# EasyEDA Pro project SSR Switch.eprj

# Schematic 250mA 48V AC/DC
Board Name: V3.0.0; Create Date: 2026-01-19; Page Name: Main Page; Project Name: SSR Switch; Schematic Name: 250mA 48V AC/DC; Update Date: 2026-01-19
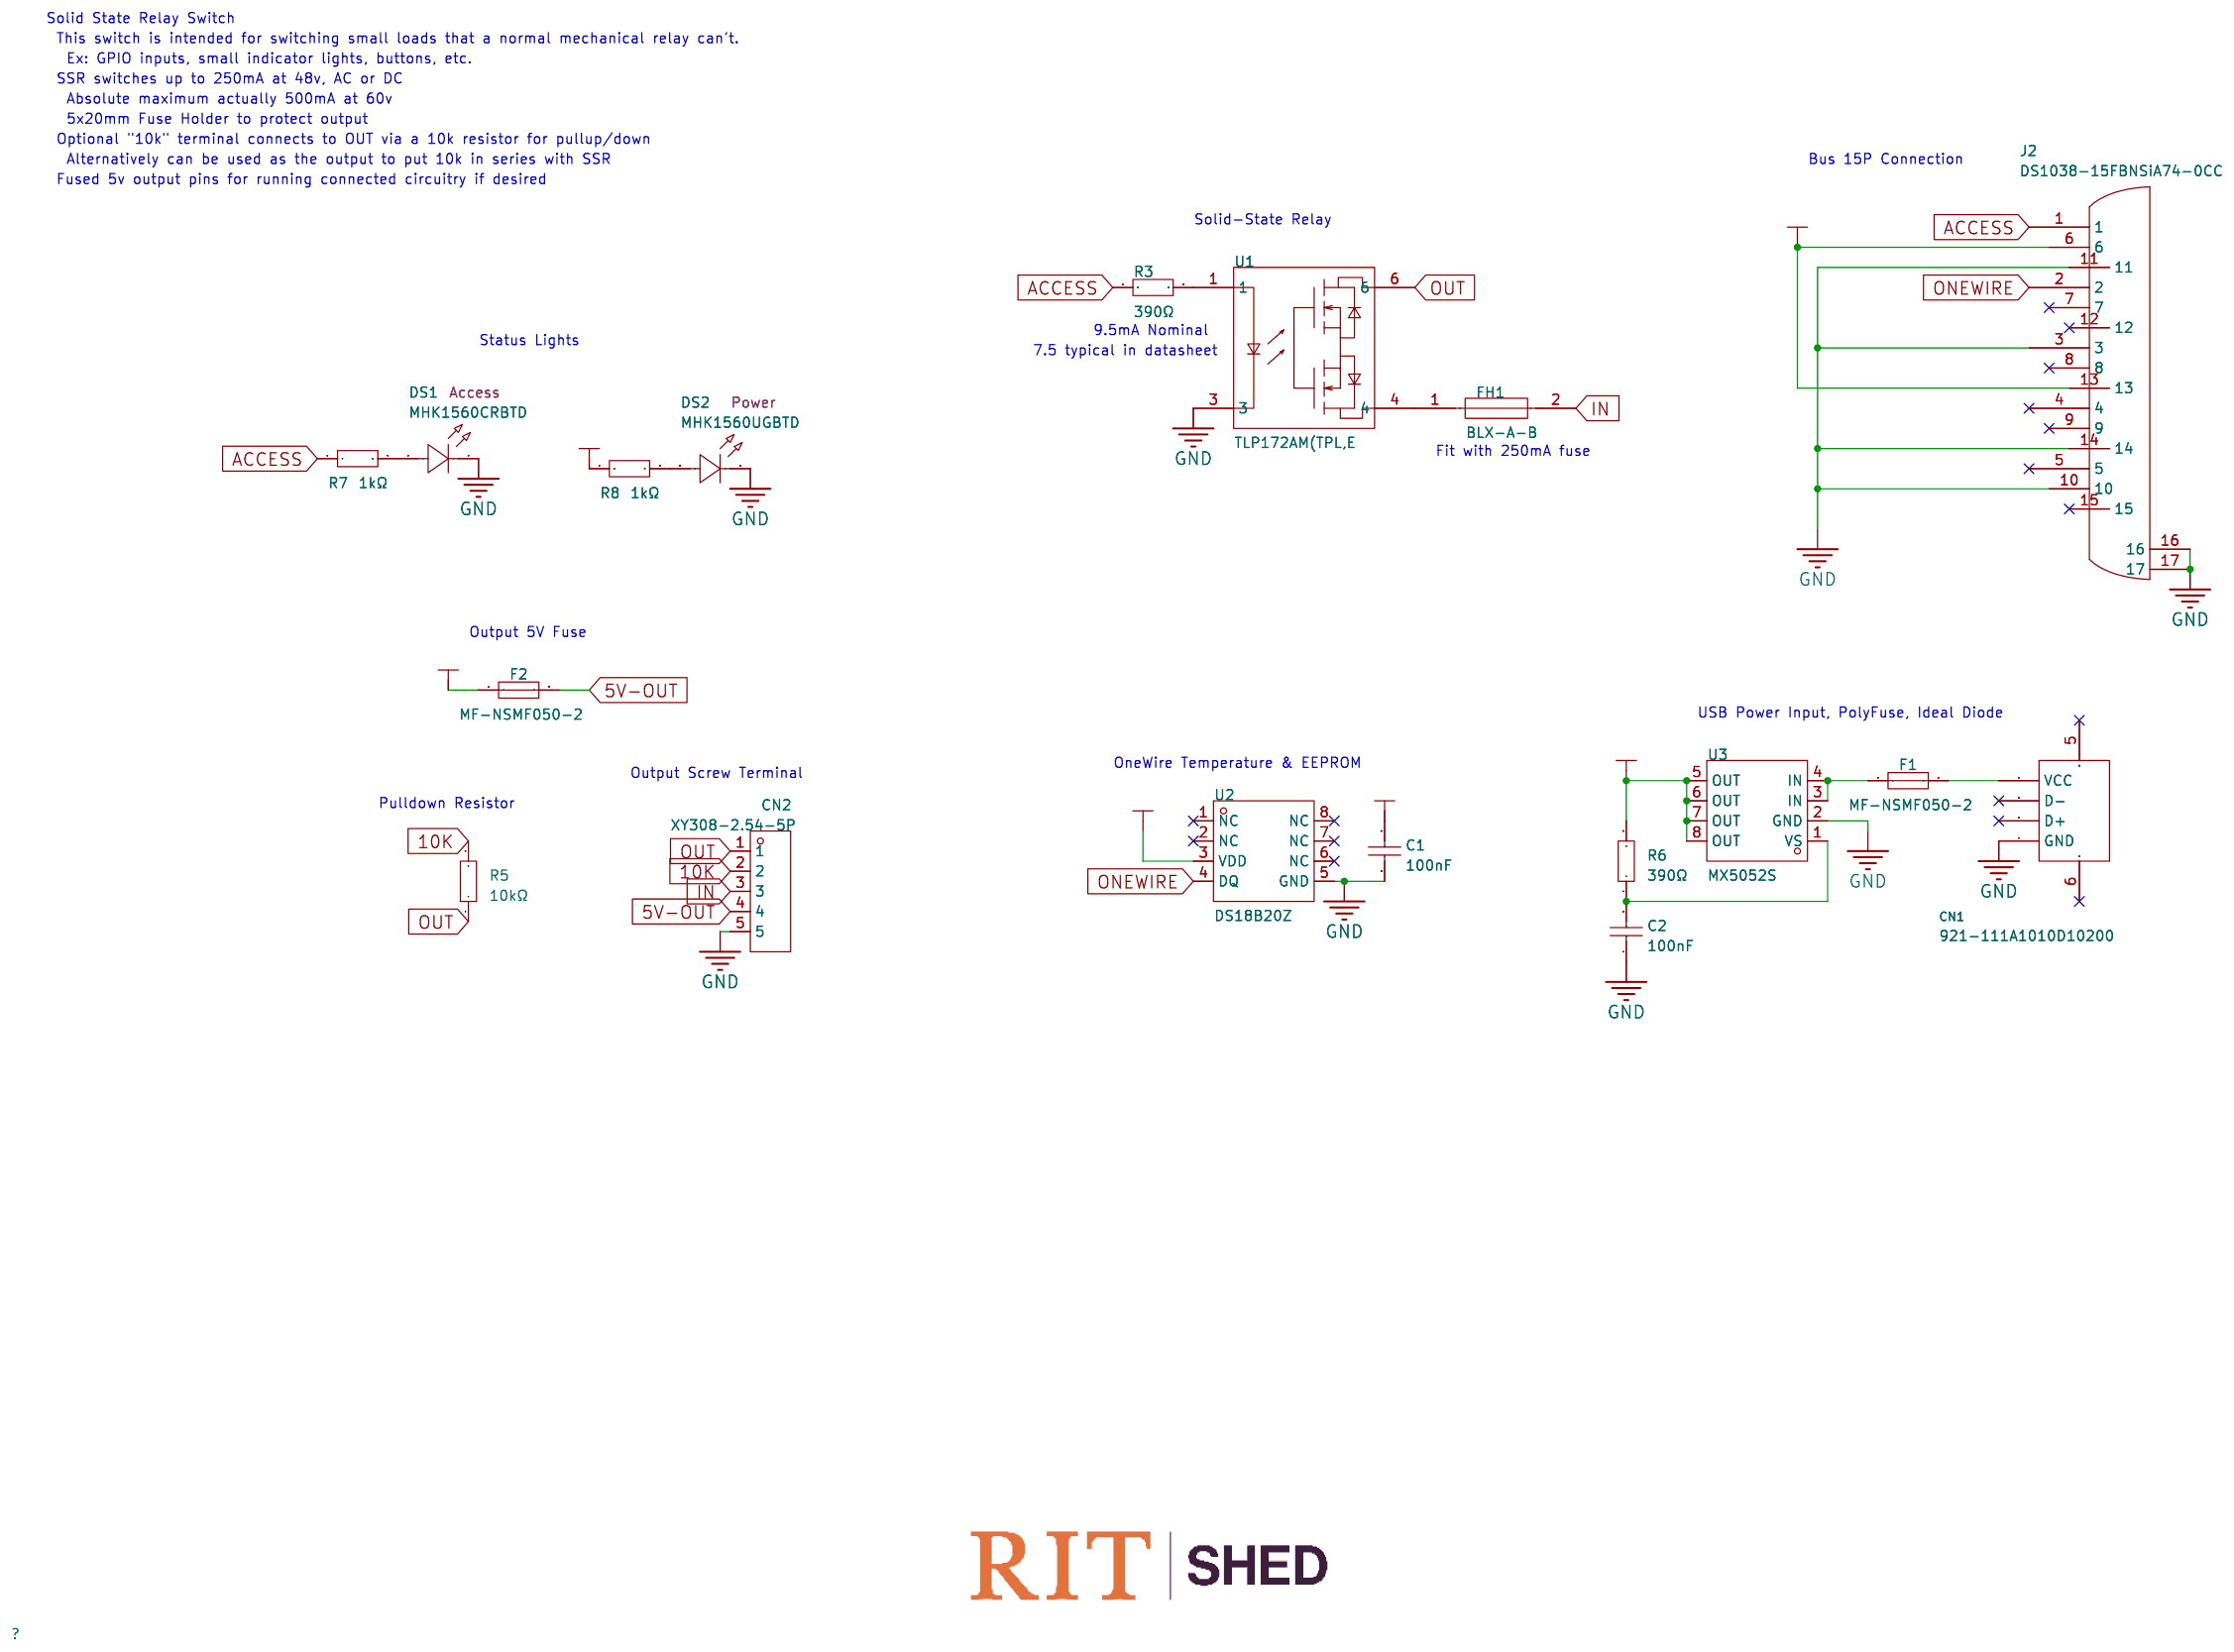
[diagram p0: schematic sheet]

## Parts
C1  100nF  [C0805]
C2  100nF  [C0805]
CN1  921-111A1010D10200  [USB-B_TH_USB-B-FEMALE-90]
CN2  XY308-2.54-5P  [CONN-TH_XY308-2.54-5P]
DS1  MHK1560CRBTD  [LED-TH_MHK1560UGBTD]
DS2  MHK1560UGBTD  [LED-TH_MHK1560UGBTD]
F1  MF-NSMF050-2  [F1206]
F2  MF-NSMF050-2  [F1206]
FH1  BLX-A-B  [FUSE-TH_BLX-A-B]
J2  DS1038-15FBNSiA74-0CC  [DSUB-TH_DS1038-15FBNSIA74-0CC]
R3  390Ω  [R0805]
R5  10kΩ  [R0805]
R6  390Ω  [R0805]
R7  1kΩ  [R0805]
R8  1kΩ  [R0805]
U1  TLP172AM(TPL,E  [SOP-6_4P-L3.7-W4.6-P2.54-LS7.0-BL]
U2  DS18B20Z  [SOP-8_L4.9-W3.9-P1.27-LS6.0-BL]
U3  MX5052S  [SOP-8_L4.9-W3.9-P1.27-LS6.0-BL]

## Library data of the parts
C1 C2 = CL21B104KCFNNNE: LCSC Part Name: 100nF ±10% 100V; Supplier Part: C28233; Manufacturer: SAMSUNG(三星); Supplier Footprint: 0805; JLCPCB Part Class: Basic Part; Datasheet: https://item.szlcsc.com/datasheet/CL21B104KCFNNNE/28983.html; Supplier: LCSC; Tolerance: ±10%; Voltage Rating: 100V; Temperature Coefficient: X7R
CN1 = 921-111A1010D10200: LCSC Part Name: Type-B 母 弯插; Supplier Part: C46392; Manufacturer: 精拓金; Supplier Footprint: 插件; Datasheet: https://item.szlcsc.com/datasheet/921-111A1010D10200/47396.html; Supplier: LCSC; Connector Type: Type-B; Protocol Standard: USB 2.0; Gender: Female; Mounting Type: Right Angle; Number of Contacts: 4P; Number of Ports: 1; Length: 16.3mm; Detection color: White
CN2 = XY308-2.54-5P: LCSC Part Name: 1x5P 2.54mm 直插 排数:1 每排P数:5; Supplier Part: C915914; Manufacturer: XINLAIYA(新莱亚); Supplier Footprint: 插件,P=2.54mm; Datasheet: https://item.szlcsc.com/datasheet/XY308-2.54-5P/989796.html; Supplier: LCSC; Number of Positions or Pins: 1x5P; Pitch: 2.54mm; Color: Green; Mounting Type: Through Hole; Number of Pins: 5P; Number of Rows: 1; Number of PINs Per Row: 5; Screw Specification: M1.6; Current Rating: 6A; Voltage Rating (Max): 150V; Wire Gauge - AWG: 18~26; Wire Gauge - mm2: 1
DS1 = MHK1560CGBTD: 20mA 雾状红透镜 50mcd -40℃~+85℃ 632nm Red 85° 1.75V~2.2V Plugin,P=2.54mm Light Emitting Diodes (LED) ROHS; LCSC Part Name: 1560直插单灯翠绿色光; Supplier Part: C7470835; Manufacturer: MEIHUA(美华); Supplier Footprint: 插件,P=2.54mm; JLCPCB Part Class: Extended Part; Datasheet: https://atta.szlcsc.com/upload/public/pdf/source/20231114/0151DB1F997DCF286213A722D08B4BAA.pdf; Supplier: LCSC; Emitted Color: Red; Forward Voltage (VF): 1.75V~2.2V; Forward Current: 20mA; Dominant Wavelength: 520nm; Lens Color: 雾状绿透镜; Luminous Intensity: 1000mcd; Viewing Angle: 85°; Operating Temperature: -40℃~+85℃; Note: Access
DS2 = MHK1560UGBTD: Emitted Color:Emerald Forward Voltage (VF):1.75V~2.2V Forward Voltage (VF):1.75V~2.2V Forward Current:20mA Dominant Wavelength:520nm Dominant Wavelength:520nm Lens Color:雾状绿透镜 Luminous Intensity:1000mcd Luminous Intensity:1000mcd Viewing Angle:85° Operati; LCSC Part Name: 1560直插单灯翠绿色光; Supplier Part: C7470833; Manufacturer: MEIHUA(美华); Supplier Footprint: 插件,P=2.54mm; JLCPCB Part Class: Extended Part; Datasheet: https://atta.szlcsc.com/upload/public/pdf/source/20231114/0151DB1F997DCF286213A722D08B4BAA.pdf; Supplier: LCSC; Emitted Color: Emerald; Forward Voltage (VF): 1.75V~2.2V; Forward Current: 20mA; Dominant Wavelength: 520nm; Lens Color: 雾状绿透镜; Luminous Intensity: 1000mcd; Viewing Angle: 85°; Operating Temperature: -40℃~+85℃; Note: Power
F1 F2 = MF-NSMF050-2: LCSC Part Name: 0.5A 13.2V 自恢复保险丝; Supplier Part: C75464; Manufacturer: BOURNS; Supplier Footprint: 1206; Datasheet: https://item.szlcsc.com/datasheet/MF-NSMF050-2/76588.html; Supplier: LCSC; Resistance - Initial (Ri) (Min): 150mΩ; Resistance - Post Trip (R1) (Max): 700mΩ; Operating Temperature: -40℃~+85℃
FH1 = BLX-A-B: LCSC Part Name: 10A 500V 支座型; Supplier Part: C41371862; Manufacturer: XFCN(兴飞); Supplier Footprint: 插件,P=22.3mm; JLCPCB Part Class: Extended Part; Datasheet: https://item.szlcsc.com/datasheet/BLX-A-B/43135983.html; Supplier: LCSC; Fuseholder Type: Bracket type; Number of Circuits: 1; Voltage Rating: 500V; Current Rating: 10A; Fuse Diameter (φD): 5.2mm; Fuse Length: 20mm
J2 = DS1038-15FBNSiA74-0CC: Connector Type:High Density D-Sub Gender:Female Number of Pins:15P Mounting Type:Right Angle Number of Rows:3 Current Rating-Signal:3A Current Rating-Power:- Voltage Rating:- Color:Black Operating Temperature:-40℃~+105℃ Operating Temperature:-40℃~+105℃; LCSC Part Name: 黑色 1000/盒 D-Sub 母 P数:15P; Supplier Part: C75754; Manufacturer: CONNFLY; Supplier Footprint: 弯插; JLCPCB Part Class: Extended Part; Datasheet: https://item.szlcsc.com/datasheet/DS1038-15FBNSiA74-0CC/76880.html; Supplier: LCSC; Connector Type: High Density D-Sub; Gender: Female; Number of Pins: 15P; Mounting Type: Right Angle; Number of Rows: 3; Current Rating-Signal: 3A; Color: Black; Operating Temperature: -40℃~+105℃
R3 R6 = 0805W8F3900T5E: LCSC Part Name: 390Ω ±1% 125mW 厚膜电阻; Supplier Part: C17655; Manufacturer: UNI-ROYAL(厚声); Supplier Footprint: 0805; Datasheet: https://item.szlcsc.com/datasheet/0805W8F3900T5E/18343.html; Supplier: LCSC; Type: Thick Film Resistor; Tolerance: ±1%; Power(Watts): 125mW; Voltage-Supply(Max): 150V; Temperature Coefficient: ±100ppm/℃; Operating Temperature: -55℃~+155℃
R5 = 0805W8F1002T5E: LCSC Part Name: 10kΩ ±1% 125mW 厚膜电阻; Supplier Part: C17414; Manufacturer: UNI-ROYAL(厚声); Supplier Footprint: 0805; JLCPCB Part Class: Basic Part; Datasheet: https://item.szlcsc.com/datasheet/0805W8F1002T5E/18102.html; Supplier: LCSC; Type: Thick Film Resistor; Tolerance: ±1%; Power(Watts): 125mW; Voltage-Supply(Max): 150V; Temperature Coefficient: ±100ppm/℃; Operating Temperature: -55℃~+155℃
R7 R8 = 0805W8F1001T5E: LCSC Part Name: 1kΩ ±1% 125mW 厚膜电阻; Supplier Part: C17513; Manufacturer: UNI-ROYAL(厚声); Supplier Footprint: 0805; Datasheet: https://atta.szlcsc.com/upload/public/pdf/source/20200306/C422600_1E6D84923E4A46A82E41ADD87F860B5C.pdf; Supplier: LCSC; Type: Thick Film Resistors; Tolerance: ±1%; Temperature Coefficient: ±100ppm/℃; Operating Temperature Range: -55℃~+155℃
U1 = TLP172AM(TPL,E: LCSC Part Name: 1 Form A(SPSTNO) 负载AC,DC 负载电压60V; Supplier Part: C2152276; Manufacturer: TOSHIBA(东芝); Supplier Footprint: SOP-4-2.54mm; JLCPCB Part Class: Extended Part; Datasheet: https://item.szlcsc.com/datasheet/TLP172AM(TPL%252CE/2244324.html; Supplier: LCSC; Contact Form: SPST-NO(1 Form A); Voltage - Forward(Vf): 1.27V; Load Voltage: 60V; Load Current: 500mA; RDS(on): 1Ω; Isolation Voltage(Vrms): 3.75kV; Turn-on time: 600us; Turn-off time: 100us; Operating Temperature: -40℃~+110℃
U2 = DS18B20Z: Resolution:±0.4℃ Resolution:±0.4℃ Supply Voltage:2.5V~5.5V Supply Voltage:2.5V~5.5V; LCSC Part Name: 温度传感器; Supplier Part: C695837; Manufacturer: UMW(友台半导体); Supplier Footprint: SOIC-8; JLCPCB Part Class: Extended Part; Datasheet: https://atta.szlcsc.com/upload/public/pdf/source/20231109/DC3DA9D47D486EF40A6E0F08B9A498E3.pdf; Supplier: LCSC; Resolution: ±0.4℃; Supply Voltage: 2.5V~5.5V
U3 = MX5052S: LCSC Part Name: 集成MOS Oring控制器; Supplier Part: C5875696; Manufacturer: Wuxi Maxinmicro(无锡明芯微); Supplier Footprint: SOP-8; JLCPCB Part Class: Extended Part; Datasheet: https://item.szlcsc.com/datasheet/MX5052S/6809525.html; Supplier: LCSC

## Nets
5V-OUT: CN2.4 F2.2
+5V-BUS: C1.2 F2.1 J2.6 J2.13 R6.2 R8.1 U2.3(VDD) U3.5(OUT) U3.6(OUT) U3.7(OUT) U3.8(OUT)
GND: C1.1 C2.1 CN1.4(GND) CN2.5 DS1.1(K) DS2.1(K) J2.3 J2.10 J2.11 J2.14 J2.16 J2.17 U1.3 U2.5(GND) U3.2(GND)
10K: CN2.2 R5.2
ACCESS: J2.1 R3.1 R7.1
IN: CN2.3 FH1.2
ONEWIRE: J2.2 U2.4(DQ)
OUT: CN2.1 R5.1 U1.6
$1N298: FH1.1 U1.4
$1N1050: CN1.1(VCC) F1.2
$1N1094: F1.1 U3.3(IN) U3.4(IN)
$1N1299: R3.2 U1.1
$1N1652: C2.2 R6.1 U3.1(VS)
$1N2468: DS1.2(A) R7.2
$1N2547: DS2.2(A) R8.2

Not connected (* = marked no-connect by the designer): CN1 2(D-)* 3(D+)* 5(SH1)* 6(SH2)*; J2 4* 5* 7* 8* 9* 12* 15*; U2 1(NC)* 2(NC)* 6(NC)* 7(NC)* 8(NC)*

## Notes on the sheet
- Solid State Relay Switch
- This switch is intended for switching small loads that a normal mechanical relay can't.
- Ex: GPIO inputs, small indicator lights, buttons, etc.
- SSR switches up to 250mA at 48v, AC or DC
- Absolute maximum actually 500mA at 60v
- 5x20mm Fuse Holder to protect output
- Optional "10k" terminal connects to OUT via a 10k resistor for pullup/down
- Alternatively can be used as the output to put 10k in series with SSR
- Bus 15P Connection
- Fused 5v output pins for running connected circuitry if desired
- Solid-State Relay
- Status Lights
- 7.5 typical in datasheet
- 9.5mA Nominal
- Fit with 250mA fuse
- Output 5V Fuse
- USB Power Input, PolyFuse, Ideal Diode
- Output Screw Terminal
- OneWire Temperature & EEPROM
- Pulldown Resistor

# Board PCB
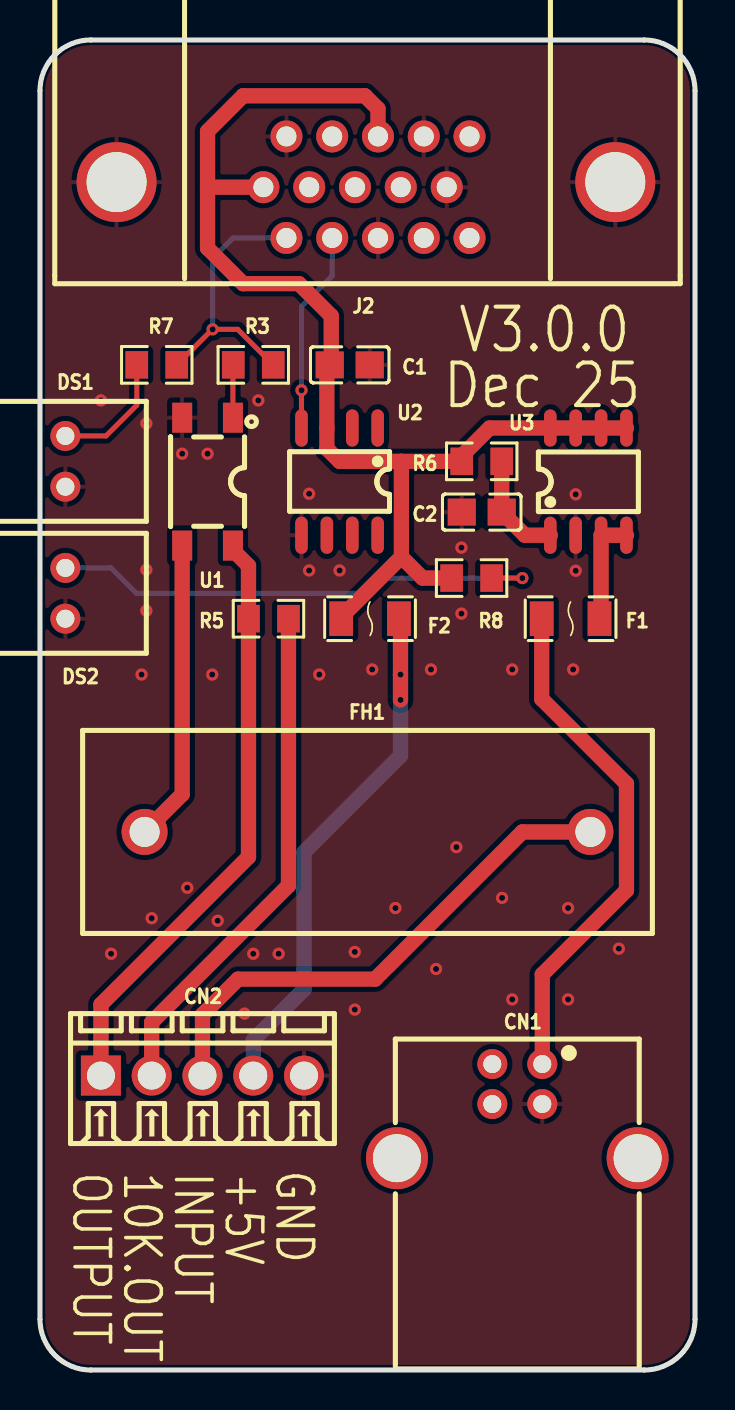
[diagram p1: board, top side]
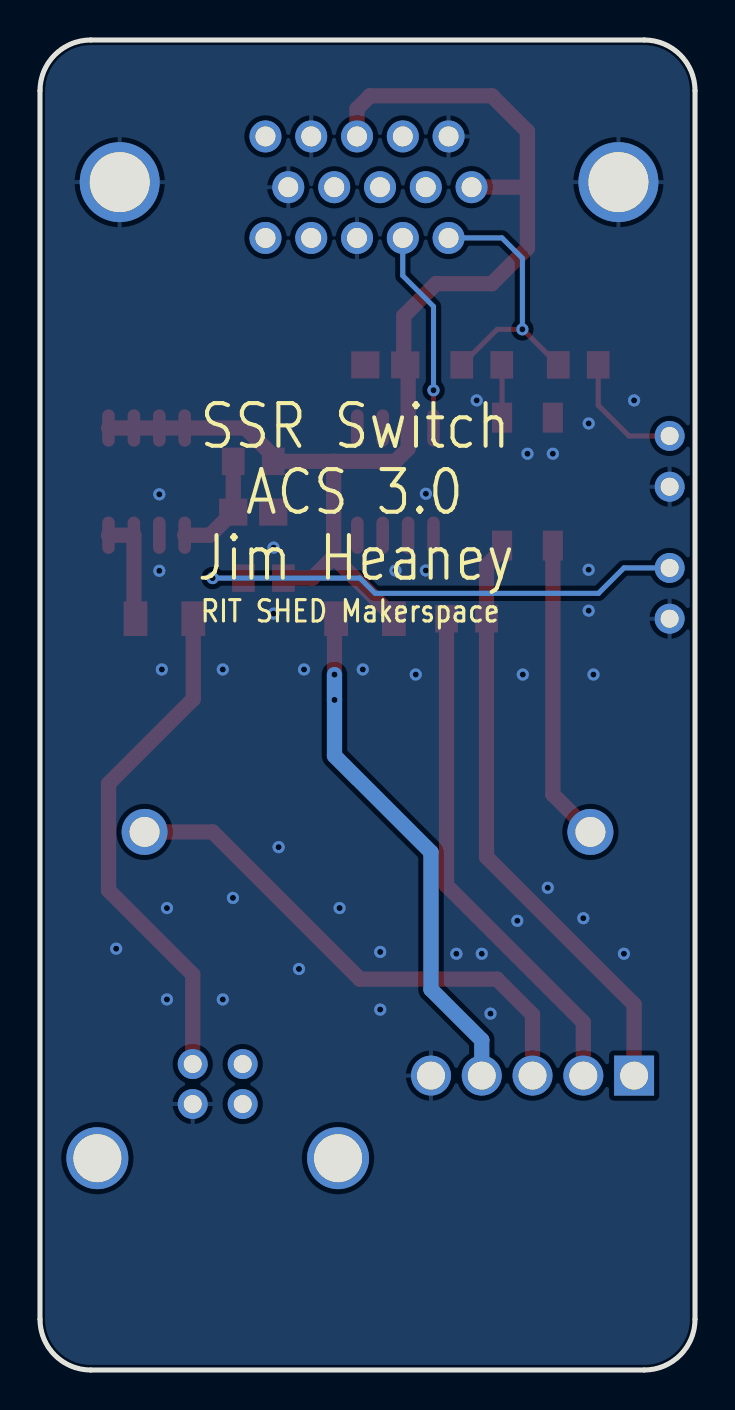
[diagram p2: board, bottom side, seen from below]

Outline 32.77 x 66.55 mm; copper layers: Top Layer, Bottom Layer. Coordinates in mm from the lower left corner of the outline.
Outline path: 0,64.01 0,2.54 arc(0.74,0.74) 2.54,0 30.23,0 arc(32.02,0.74) 32.77,2.54 32.77,64.01 arc(32.02,65.8) 30.23,66.55 2.54,66.55 arc(0.74,65.8) 0,64.01
Stack: Top Layer 0.035mm / Dielectric1 1.51mm FR4 er 4.5 / Bottom Layer 0.035mm

## Design rules (mm)
template: JLCPCB Capability(Two Layers Board)
spacing copperThickness1oz (default): track to track 0.102, other pairs 0.152 to 0.3
spacing copperThickness2oz: track to track 0.203, other pairs 0.152 to 0.3
track width copperThickness1oz (default): min 0.127, default 0.254, max 2.54
track width copperThickness2oz: min 0.203, default 0.254, max 2.54
differential pair differentialPair (default): width min 0.127, default 0.254, max 2.54; gap min 0.152, default 0.152
via viaSize (default): diameter min 0.5, default 0.61, max 10; hole min 0.3, default 0.305, max 6.3

## Placement (name value [footprint] x y rotation side)
C1  100nF  [C0805]  15.49 50.29 180 top
C2  100nF  [C0805]  22.1 42.93 0 top
CN1  921-111A1010D10200  [USB-B_TH_USB-B-FEMALE-90]  23.88 12.95 0 top
CN2  XY308-2.54-5P  [CONN-TH_XY308-2.54-5P]  8.13 14.73 0 top
DS1  MHK1560CRBTD  [LED-TH_MHK1560UGBTD]  1.27 45.47 270 top
DS2  MHK1560UGBTD  [LED-TH_MHK1560UGBTD]  1.27 38.86 270 top
F1  MF-NSMF050-2  [F1206]  26.54 37.59 180 top
F2  MF-NSMF050-2  [F1206]  16.51 37.59 0 top
FH1  BLX-A-B  [FUSE-TH_BLX-A-B]  16.38 26.92 0 top
J2  DS1038-15FBNSiA74-0CC  [DSUB-TH_DS1038-15FBNSIA74-0CC]  16.31 59.18 180 top
R3  390Ω  [R0805]  10.67 50.29 180 top
R5  10kΩ  [R0805]  11.43 37.59 0 top
R6  390Ω  [R0805]  22.1 45.47 180 top
R7  1kΩ  [R0805]  5.84 50.29 180 top
R8  1kΩ  [R0805]  21.59 39.62 0 top
U1  TLP172AM(TPL,E  [SOP-6_4P-L3.7-W4.6-P2.54-LS7.0-BL]  8.38 44.45 180 top
U2  DS18B20Z  [SOP-8_L4.9-W3.9-P1.27-LS6.0-BL]  14.99 44.45 180 top
U3  MX5052S  [SOP-8_L4.9-W3.9-P1.27-LS6.0-BL]  27.43 44.45 0 top

## Footprints (pads in the part's own frame, mm; a bottom-side part is the same pattern mirrored in y, then rotated)
C0805
  rect 1.41x1.35 smd: 1(-1,0) 2(1,0)
CONN-TH_XY308-2.54-5P
  rect 2x2 hole 1.4: 1(-5.08,0)
  round 2 hole 1.4: 2(-2.54,0) 3(0,0) 4(2.54,0) 5(5.08,0)
DSUB-TH_DS1038-15FBNSIA74-0CC
  round 1.6 hole 1: 1(3.978,2.54) 2(1.688,2.54) 3(-0.603,2.54) 4(-2.893,2.54) 5(-5.182,2.54) 6(5.128,0) 7(2.837,0) 8(0.548,0) 9(-1.743,0) 10(-4.042,0) 11(3.978,-2.54) 12(1.688,-2.54) 13(-0.603,-2.54) 14(-2.893,-2.54) 15(-5.182,-2.54)
  round 4 hole 3: 16(12.473,-0.254) 17(-12.473,-0.254)
F1206
  rect 1.19x1.728 smd: 1(-1.445,0) 2(1.445,0)
FUSE-TH_BLX-A-B
  round 2.3 hole 1.5: 1(-11.15,0) 2(11.15,0)
LED-TH_MHK1560UGBTD
  round 1.5 hole 0.9: 1(1.27,0) 2(-1.27,0)
R0805
  rect 1.133x1.377 smd: 1(-1,0) 2(1,0)
SOP-6_4P-L3.7-W4.6-P2.54-LS7.0-BL
  rect 1.001x1.5 smd: 1(-1.27,-3.2) 3(1.27,-3.2) 4(1.27,3.2) 6(-1.27,3.2)
SOP-8_L4.9-W3.9-P1.27-LS6.0-BL
  oval 0.63x1.865 smd: 1(-1.905,-2.683) 2(-0.635,-2.683) 3(0.635,-2.683) 4(1.905,-2.683) 5(1.905,2.683) 6(0.635,2.683) 7(-0.635,2.683) 8(-1.905,2.683)
USB-B_TH_USB-B-FEMALE-90
  round 1.5 hole 0.9: 1(1.25,2.355) 2(-1.25,2.355) 3(-1.25,0.355) 4(1.25,0.355)
  round 3.1 hole 2.4: 5(-6.02,-2.355) 6(6.02,-2.355)

## Nets
As in the schematic.

Pads without a net: CN1 2 3 5 6; J2 4 5 7 8 9 12 15; U2 1 2 6 7 8

## Via types
v1: diameter 0.61, hole 0.305, Top Layer to Bottom Layer, 43 vias

## Routing (per net, layer and track width the routed paths; a pad name or vN(x,y) marks a point on that pad's centre or on a via; arc(x,y) is an arc through that point)
5V-OUT: length 27.2
  Top Layer w0.762: v1(18.03,33.53) v1(18.03,34.8) 18.03,37.51 17.96,37.59
  Bottom Layer w0.762: v1(18.03,34.8) v1(18.03,33.53) 18.03,30.73 13.21,25.91 13.21,19.05 10.67,16.51 CN2.4
+5V-BUS: length 61.8
  Top Layer w0.762: J2.13 16.91,63.1 16.26,63.75 10.16,63.75 8.38,61.98 8.38,59.2 ; 18.08,40.68 19.14,39.62 R8.1 ; 18.08,40.68 15.06,37.67 F2.1 ; 18.08,40.68 18.08,45.47 ; 8.38,59.2 8.38,56.13 10.16,54.36 12.95,54.36 14.57,52.74 14.57,50.37 C1.2 14.35,50.15 U2.3 14.35,46.1 14.99,45.47 18.08,45.47 ; 8.38,59.2 8.4,59.18 J2.6 ; 18.08,45.47 R6.2 ; 21.08,45.72 22.49,47.13 U3.8 U3.7 U3.5
GND:
  vias: v1(3.05,48.51) v1(3.56,20.83) v1(5.08,34.8) v1(5.32,47.36) v1(5.32,40.04) v1(5.32,37.99) v1(5.59,22.61) v1(7.11,45.85) v1(7.37,24.13) v1(8.38,45.85) v1(8.61,34.8) v1(8.89,22.48) v1(10.23,17.83) v1(10.67,20.83) v1(10.92,48.51) v1(11.94,20.83) v1(13.46,43.84) v1(13.46,40) v1(13.97,34.8) v1(14.99,40) v1(15.75,20.92) v1(15.75,18.03) v1(16.62,35.05) v1(17.78,23.11) v1(19.56,35.05) v1(19.81,20.07) v1(20.83,26.16) v1(21.08,41.15) v1(21.08,37.85) v1(23.11,23.62) v1(23.62,35.05) v1(23.62,18.54) v1(26.42,23.11) v1(26.42,18.54) v1(26.67,35.05) v1(26.8,43.81) v1(26.8,39.99) v1(28.96,21.08)
10K: length 25.7
  Top Layer w0.762: CN2.2 5.59,17.4 12.43,24.24 R5.2
ACCESS: length 14
  Top Layer w0.254: R7.1 8.62,52.07 v1(8.64,52.07) 9.89,52.07 R3.1
  Bottom Layer w0.254: v1(8.64,52.07) 8.64,55.63 9.65,56.64 J2.1
IN: length 26.2
  Top Layer w0.762: 27.53,26.92 24.13,26.92 16.76,19.56 9.91,19.56 8.13,17.78 CN2.3
ONEWIRE: length 10.1
  Top Layer w0.254: v1(13.08,49.02) U2.4
  Bottom Layer w0.254: v1(13.08,49.02) 13.08,53.21 14.62,54.75 J2.2
OUT: length 29.9
  Top Layer w0.762: U1.6 9.65,41.02 10.43,40.24 R5.1 10.43,25.67 3.05,18.29 CN2.1
$1N298: length 15.1
  Top Layer w0.762: FH1.1 7.11,28.8 U1.4
$1N1050: length 25.8
  Top Layer w0.762: CN1.1 25.13,19.79 29.34,24 29.34,29.34 25.1,33.58 F1.2
$1N1094: length 5.5
  Top Layer w0.762: F1.1 28.07,37.67 28.07,41.77 U3.4
$1N1299: length 2.6
  Top Layer w0.254: U1.1 9.65,50.28 R3.2
$1N1652: length 5.4
  Top Layer w0.762: R6.1 C2.2 24.26,41.77 U3.1
$1N2468: length 6.2
  Top Layer w0.254: DS1.2 3.3,46.74 4.84,48.28 R7.2
$1N2547: length 25.2
  Top Layer w0.254: R8.2 v1(24.13,39.62)
  Bottom Layer w0.254: v1(24.13,39.62) 16.76,39.62 16,38.86 4.83,38.86 3.56,40.13 DS2.2

## Copper pours and planes (outline as drawn; the poured copper is in the pictures)
GND on Top Layer: -4.57,72.39 36.83,72.39 36.83,-4.57 -4.57,-4.57
GND on Bottom Layer: -3.05,71.63 38.35,71.63 38.35,-4.83 -3.05,-4.83

## Text on the board
Bottom Silkscreen Layer: RIT SHED Makerspace | ACS 3.0 | SSR Switch | Jim Heaney
Top Silkscreen Layer: OUTPUT | 10K.OUT | INPUT | +5V | GND | V3.0.0 | Dec 25
